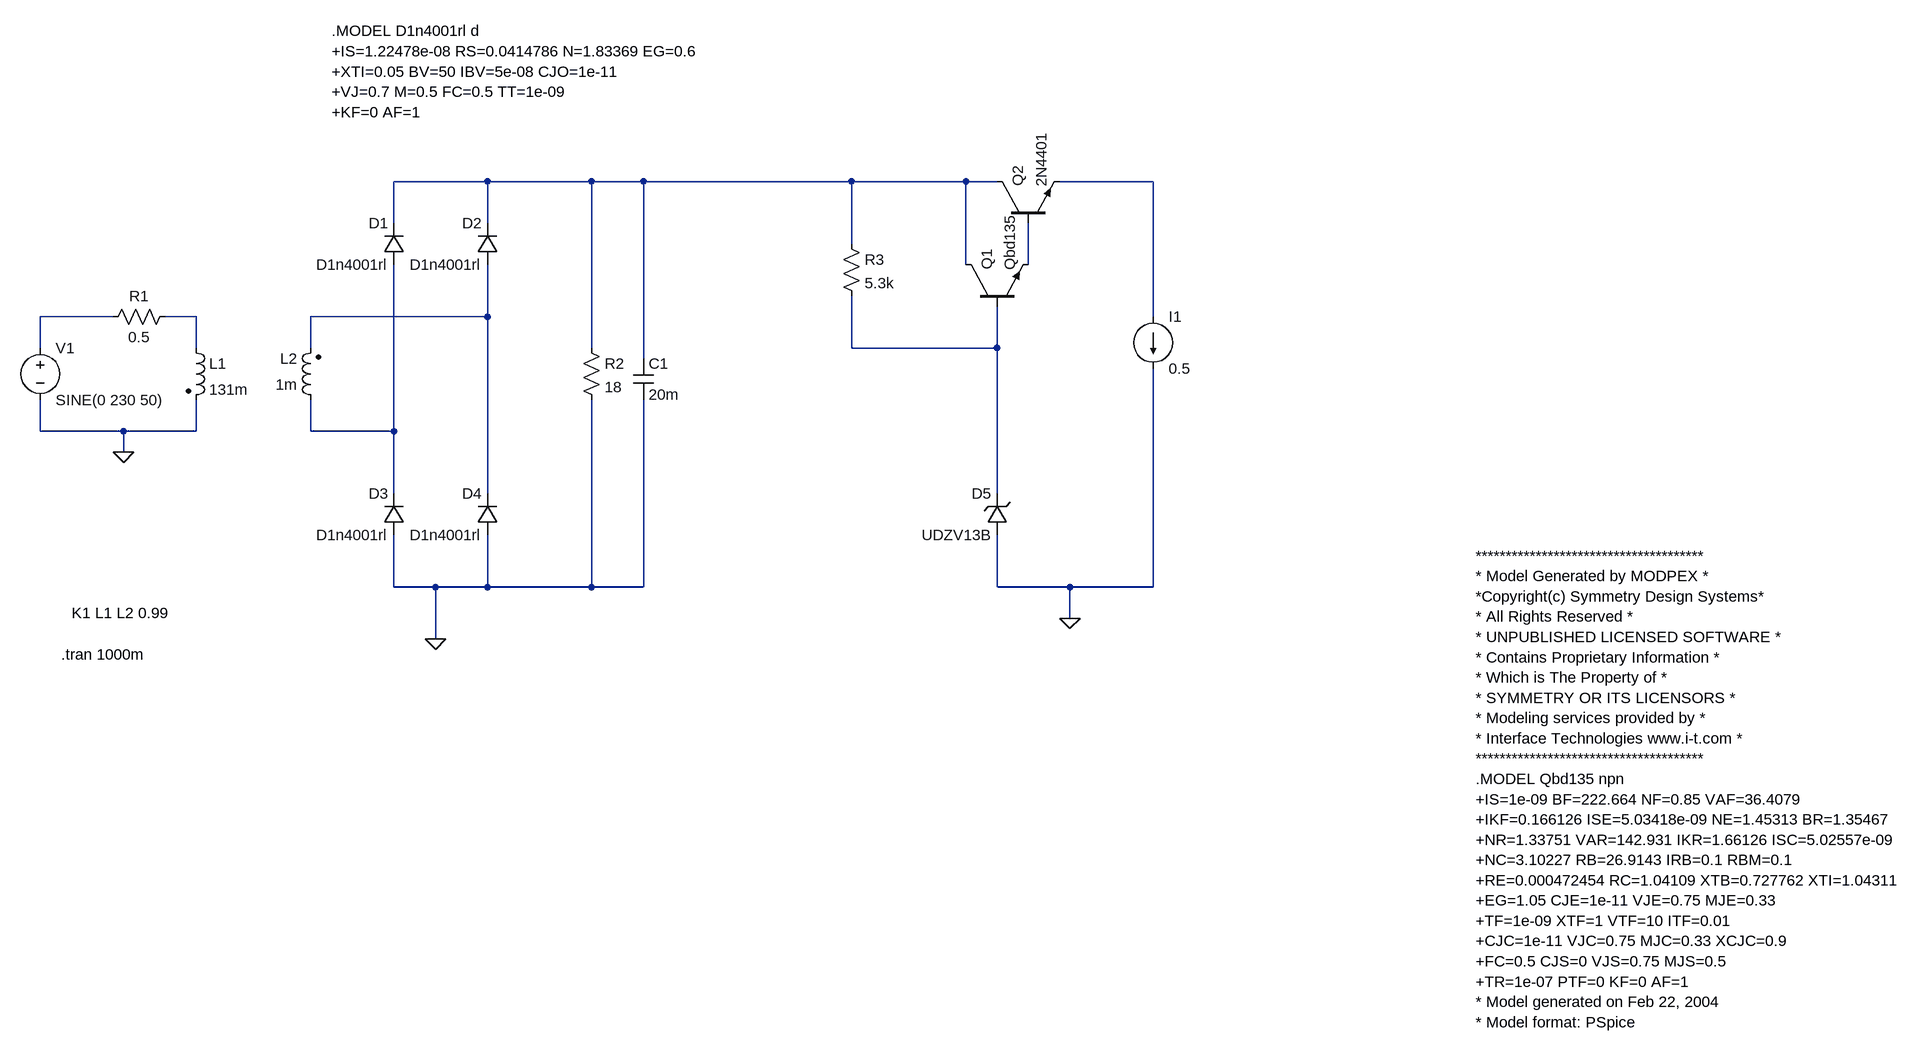
[diagram p0: schematic Draft1.asc]
Draft1.asc, the LTspice schematic file:
Version 4
SHEET 1 2464 1404
WIRE 224 -160 80 -160
WIRE 384 -160 224 -160
WIRE 464 -160 384 -160
WIRE 784 -160 464 -160
WIRE 960 -160 784 -160
WIRE 1008 -160 960 -160
WIRE 1248 -160 1104 -160
WIRE 80 -96 80 -160
WIRE 224 -96 224 -160
WIRE 784 -64 784 -160
WIRE 960 -32 960 -160
WIRE 1056 -32 1056 -96
WIRE -352 48 -464 48
WIRE -224 48 -272 48
WIRE 224 48 224 -32
WIRE 224 48 -48 48
WIRE 1248 48 1248 -160
WIRE -464 96 -464 48
WIRE -224 96 -224 48
WIRE -48 96 -48 48
WIRE 384 96 384 -160
WIRE 784 96 784 16
WIRE 1008 96 1008 32
WIRE 1008 96 784 96
WIRE 464 112 464 -160
WIRE -464 224 -464 176
WIRE -336 224 -464 224
WIRE -224 224 -224 176
WIRE -224 224 -336 224
WIRE -48 224 -48 176
WIRE 80 224 80 -32
WIRE 80 224 -48 224
WIRE -336 256 -336 224
WIRE 80 320 80 224
WIRE 224 320 224 48
WIRE 1008 320 1008 96
WIRE 80 464 80 384
WIRE 144 464 80 464
WIRE 224 464 224 384
WIRE 224 464 144 464
WIRE 384 464 384 176
WIRE 384 464 224 464
WIRE 464 464 464 176
WIRE 464 464 384 464
WIRE 1008 464 1008 384
WIRE 1120 464 1008 464
WIRE 1248 464 1248 128
WIRE 1248 464 1120 464
WIRE 1120 512 1120 464
WIRE 144 544 144 464
FLAG -336 256 0
FLAG 144 544 0
FLAG 1120 512 0
SYMBOL ind2 -240 80 R0
SYMATTR InstName L1
SYMATTR Type ind
SYMATTR Value 131m
SYMBOL ind2 -32 192 R180
WINDOW 0 36 80 Left 2
WINDOW 3 36 40 Left 2
SYMATTR InstName L2
SYMATTR Value 1m
SYMATTR Type ind
SYMBOL res -256 32 R90
WINDOW 0 0 56 VBottom 2
WINDOW 3 32 56 VTop 2
SYMATTR InstName R1
SYMATTR Value 0.5
SYMBOL voltage -464 80 R0
WINDOW 123 0 0 Left 0
WINDOW 39 0 0 Left 0
SYMATTR InstName V1
SYMATTR Value SINE(0 230 50)
SYMBOL res 368 80 R0
SYMATTR InstName R2
SYMATTR Value 18
SYMBOL cap 448 112 R0
SYMATTR InstName C1
SYMATTR Value 20m
SYMBOL diode 96 -32 R180
WINDOW 0 24 64 Left 2
WINDOW 3 24 0 Left 2
SYMATTR InstName D1
SYMATTR Value D1n4001rl
SYMBOL diode 240 -32 R180
WINDOW 0 24 64 Left 2
WINDOW 3 24 0 Left 2
SYMATTR InstName D2
SYMATTR Value D1n4001rl
SYMBOL diode 96 384 R180
WINDOW 0 24 64 Left 2
WINDOW 3 24 0 Left 2
SYMATTR InstName D3
SYMATTR Value D1n4001rl
SYMBOL diode 240 384 R180
WINDOW 0 24 64 Left 2
WINDOW 3 24 0 Left 2
SYMATTR InstName D4
SYMATTR Value D1n4001rl
SYMBOL res 768 -80 R0
SYMATTR InstName R3
SYMATTR Value 5.3k
SYMBOL npn 960 32 R270
SYMATTR InstName Q1
SYMATTR Value Qbd135
SYMBOL npn 1008 -96 R270
SYMATTR InstName Q2
SYMATTR Value 2N4401
SYMBOL zener 1024 384 R180
WINDOW 0 24 64 Left 2
WINDOW 3 24 0 Left 2
SYMATTR InstName D5
SYMATTR Value UDZV13B
SYMBOL current 1248 48 R0
WINDOW 123 0 0 Left 0
WINDOW 39 0 0 Left 0
SYMATTR InstName I1
SYMATTR Value 0.5
TEXT -16 -392 Left 2 !.MODEL D1n4001rl d \n+IS=1.22478e-08 RS=0.0414786 N=1.83369 EG=0.6\n+XTI=0.05 BV=50 IBV=5e-08 CJO=1e-11\n+VJ=0.7 M=0.5 FC=0.5 TT=1e-09\n+KF=0 AF=1
TEXT -432 568 Left 2 !.tran 1000m
TEXT -416 504 Left 2 !K1 L1 L2 0.99
TEXT 1744 416 Left 2 !**************************************\n* Model Generated by MODPEX *\n*Copyright(c) Symmetry Design Systems*\n* All Rights Reserved *\n* UNPUBLISHED LICENSED SOFTWARE *\n* Contains Proprietary Information *\n* Which is The Property of *\n* SYMMETRY OR ITS LICENSORS *\n* Modeling services provided by *\n* Interface Technologies www.i-t.com *\n**************************************\n.MODEL Qbd135 npn\n+IS=1e-09 BF=222.664 NF=0.85 VAF=36.4079\n+IKF=0.166126 ISE=5.03418e-09 NE=1.45313 BR=1.35467\n+NR=1.33751 VAR=142.931 IKR=1.66126 ISC=5.02557e-09\n+NC=3.10227 RB=26.9143 IRB=0.1 RBM=0.1\n+RE=0.000472454 RC=1.04109 XTB=0.727762 XTI=1.04311\n+EG=1.05 CJE=1e-11 VJE=0.75 MJE=0.33\n+TF=1e-09 XTF=1 VTF=10 ITF=0.01\n+CJC=1e-11 VJC=0.75 MJC=0.33 XCJC=0.9\n+FC=0.5 CJS=0 VJS=0.75 MJS=0.5\n+TR=1e-07 PTF=0 KF=0 AF=1\n* Model generated on Feb 22, 2004\n* Model format: PSpice

The netlist it stands for:
* Draft1.asc
L1 N005 0 131m
L2 N008 N006 1m
R1 N005 N004 0.5
V1 N004 0 SINE(0 230 50)
R2 N001 0 18
C1 N001 0 20m
D1 N008 N001 D1n4001rl
D2 N006 N001 D1n4001rl
D3 0 N008 D1n4001rl
D4 0 N006 D1n4001rl
R3 N001 N007 5.3k
Q1 N001 N007 N003 0 Qbd135
Q2 N001 N003 N002 0 2N4401
D5 0 N007 UDZV13B
I1 N002 0 0.5
.model D D
.lib standard.dio
.model NPN NPN
.model PNP PNP
.lib standard.bjt
.MODEL D1n4001rl d
+IS=1.22478e-08 RS=0.0414786 N=1.83369 EG=0.6
+XTI=0.05 BV=50 IBV=5e-08 CJO=1e-11
+VJ=0.7 M=0.5 FC=0.5 TT=1e-09
+KF=0 AF=1
.tran 1000m
K1 L1 L2 0.99
**************************************
* Model Generated by MODPEX *
*Copyright(c) Symmetry Design Systems*
* All Rights Reserved *
* UNPUBLISHED LICENSED SOFTWARE *
* Contains Proprietary Information *
* Which is The Property of *
* SYMMETRY OR ITS LICENSORS *
* Modeling services provided by *
* Interface Technologies www.i-t.com *
**************************************
.MODEL Qbd135 npn
+IS=1e-09 BF=222.664 NF=0.85 VAF=36.4079
+IKF=0.166126 ISE=5.03418e-09 NE=1.45313 BR=1.35467
+NR=1.33751 VAR=142.931 IKR=1.66126 ISC=5.02557e-09
+NC=3.10227 RB=26.9143 IRB=0.1 RBM=0.1
+RE=0.000472454 RC=1.04109 XTB=0.727762 XTI=1.04311
+EG=1.05 CJE=1e-11 VJE=0.75 MJE=0.33
+TF=1e-09 XTF=1 VTF=10 ITF=0.01
+CJC=1e-11 VJC=0.75 MJC=0.33 XCJC=0.9
+FC=0.5 CJS=0 VJS=0.75 MJS=0.5
+TR=1e-07 PTF=0 KF=0 AF=1
* Model generated on Feb 22, 2004
* Model format: PSpice
.backanno
.end